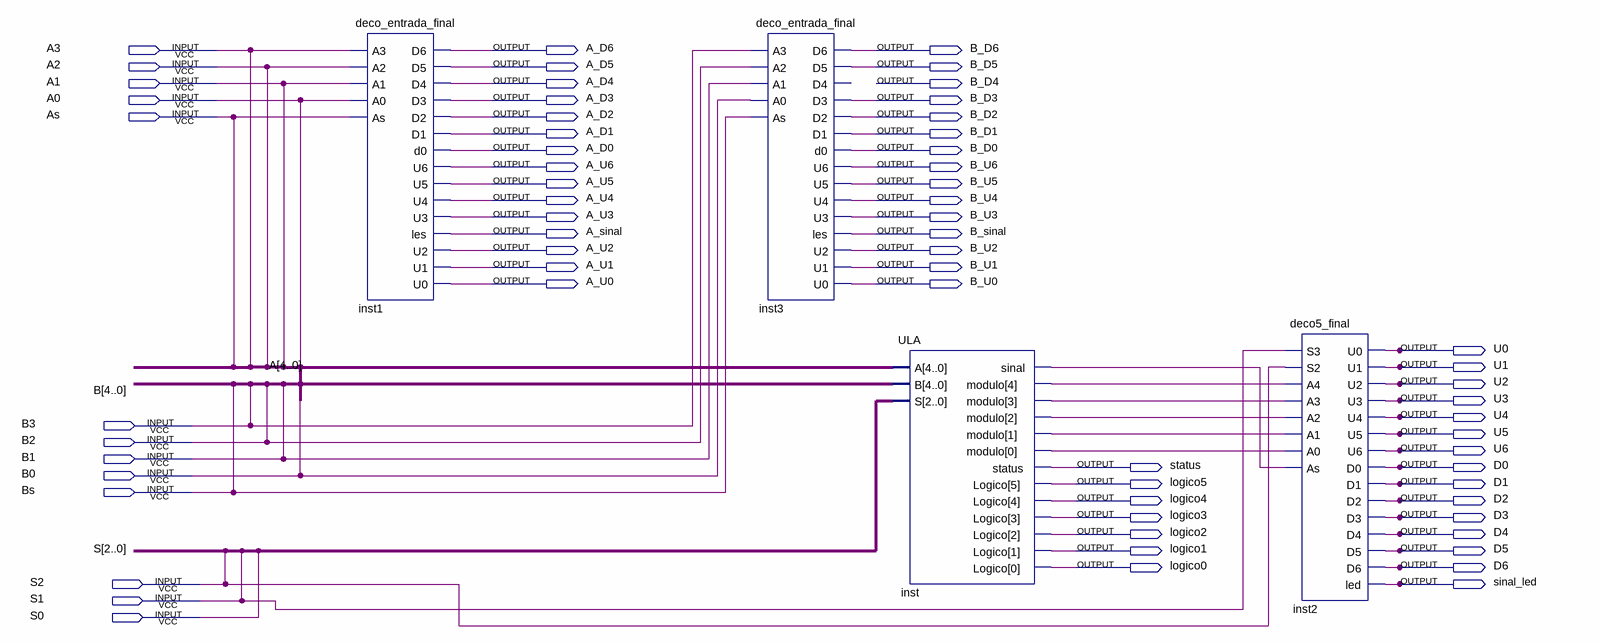
[diagram p0: schematic sheet]
// Quartus schematic projeto.bdf as structural Verilog: 4 symbols, 65 pins
module projeto (
  input  A3,
  input  A2,
  input  A1,
  input  A0,
  input  As,
  input  B3,
  input  B2,
  input  B1,
  input  B0,
  input  Bs,
  input  S2,
  input  S1,
  input  S0,
  output A_D6,
  output B_D6,
  output A_D5,
  output B_D5,
  output A_D4,
  output B_D4,
  output A_D3,
  output B_D3,
  output A_D2,
  output B_D2,
  output A_D1,
  output B_D1,
  output A_D0,
  output B_D0,
  output A_U6,
  output B_U6,
  output A_U5,
  output B_U5,
  output A_U4,
  output B_U4,
  output A_U3,
  output B_U3,
  output A_sinal,
  output B_sinal,
  output A_U2,
  output B_U2,
  output A_U1,
  output B_U1,
  output A_U0,
  output B_U0,
  output U0,
  output U1,
  output U2,
  output U3,
  output U4,
  output U5,
  output U6,
  output status,
  output D0,
  output logico5,
  output D1,
  output logico4,
  output D2,
  output logico3,
  output D3,
  output logico2,
  output D4,
  output logico1,
  output D5,
  output logico0,
  output D6,
  output sinal_led
);

  wire inst_modulo, inst_modulo_2, inst_modulo_3, inst_modulo_4, inst_modulo_5, inst_sinal;

  deco_entrada_final inst1 (
    .A3(A3), .A2(A2), .A1(A1), .A0(A0), .As(As), .D6(A_D6), .D5(A_D5), .D4(A_D4), .D3(A_D3), .D2(A_D2),
    .D1(A_D1), .d0(A_D0), .U6(A_U6), .U5(A_U5), .U4(A_U4), .U3(A_U3), .les(A_sinal), .U2(A_U2), .U1(A_U1),
    .U0(A_U0));
  deco_entrada_final inst3 (
    .A3(B3), .A2(B2), .A1(B1), .A0(B0), .As(Bs), .D6(B_D6), .D5(B_D5), .D3(B_D3), .D2(B_D2), .D1(B_D1),
    .d0(B_D0), .U6(B_U6), .U5(B_U5), .U4(B_U4), .U3(B_U3), .les(B_sinal), .U2(B_U2), .U1(B_U1), .U0(B_U0));  // open: D4
  ULA inst (
    .A({As, A3, A2, A1, A0}), .B({Bs, B3, B2, B1, B0}), .S({S2, S1, S0}), .sinal(inst_sinal),
    .modulo({inst_modulo, inst_modulo_2, inst_modulo_3, inst_modulo_4, inst_modulo_5}), .status(status),
    .Logico({logico5, logico4, logico3, logico2, logico1, logico0}));
  deco5_final inst2 (
    .S3(S1), .S2(S2), .A4(inst_modulo), .A3(inst_modulo_2), .A2(inst_modulo_3), .A1(inst_modulo_4),
    .A0(inst_modulo_5), .As(inst_sinal), .U0(U0), .U1(U1), .U2(U2), .U3(U3), .U4(U4), .U5(U5), .U6(U6),
    .D0(D0), .D1(D1), .D2(D2), .D3(D3), .D4(D4), .D5(D5), .D6(D6), .led(sinal_led));

  // Other names for the same wires on the sheet: A[4] = As; B[4] = Bs
endmodule
